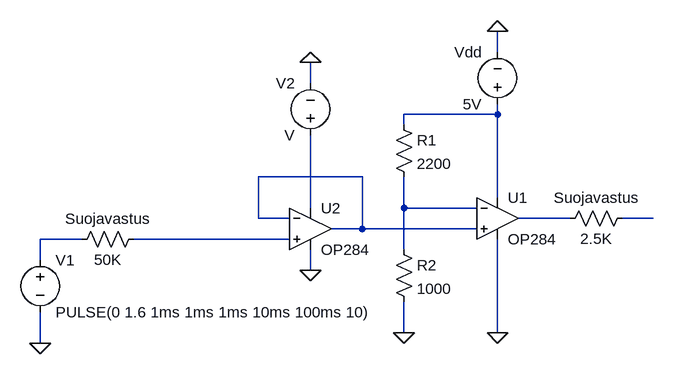
[diagram p0: schematic Ilmankosteus_in.asc]
Ilmankosteus_in.asc, the LTspice schematic file:
Version 4.1
SHEET 1 880 680
WIRE 224 -112 224 -144
WIRE -64 -64 -64 -96
WIRE 224 -16 224 -32
WIRE 224 -16 80 -16
WIRE 80 0 80 -16
WIRE 16 80 -144 80
WIRE 224 112 224 -16
WIRE -64 128 -64 16
WIRE 80 128 80 80
WIRE 192 128 80 128
WIRE -144 144 -144 80
WIRE -96 144 -144 144
WIRE 336 144 256 144
WIRE 464 144 416 144
WIRE 16 160 16 80
WIRE 16 160 -32 160
WIRE 192 160 16 160
WIRE -416 176 -480 176
WIRE -96 176 -336 176
WIRE 80 192 80 128
WIRE -480 208 -480 176
WIRE -64 224 -64 192
WIRE 80 320 80 272
WIRE 224 320 224 176
WIRE -480 336 -480 288
FLAG 80 320 0
FLAG 224 -144 0
FLAG 224 320 0
FLAG -480 336 0
FLAG -64 -96 0
FLAG -64 224 0
SYMBOL OpAmps\\OP284 224 80 R0
SYMATTR InstName U1
SYMBOL res 64 -16 R0
SYMATTR InstName R1
SYMATTR Value 2200
SYMBOL res 64 176 R0
SYMATTR InstName R2
SYMATTR Value 1000
SYMBOL voltage 224 -16 R180
WINDOW 0 24 96 Left 2
WINDOW 3 24 16 Left 2
SYMATTR InstName Vdd
SYMATTR Value 5V
SYMBOL OpAmps\\OP284 -64 96 R0
SYMATTR InstName U2
SYMBOL voltage -480 192 R0
WINDOW 123 0 0 Left 0
WINDOW 39 0 0 Left 0
SYMATTR InstName V1
SYMATTR Value PULSE(0 1.6 1ms 1ms 1ms 10ms 100ms 10)
SYMBOL res -320 160 R90
WINDOW 0 0 56 VBottom 2
WINDOW 3 32 56 VTop 2
SYMATTR InstName Suojavastus
SYMATTR Value 50K
SYMBOL voltage -64 32 R180
WINDOW 0 24 96 Left 2
WINDOW 3 24 16 Left 2
SYMATTR InstName V2
SYMBOL res 432 128 R90
WINDOW 0 0 56 VBottom 2
WINDOW 3 32 56 VTop 2
SYMATTR InstName Suojavastus
SYMATTR Value 2.5K

The netlist it stands for:
* Ilmankosteus_in.asc
X§U1 N002 N004 N001 0 N005 OP284  ; pins In+ In- V+ V- OUT
R1 N001 N004 2200
R2 N004 0 1000
Vdd N001 0 5V
X§U2 N008 N002 N003 0 N002 OP284  ; pins In+ In- V+ V- OUT
V1 N007 0 PULSE(0 1.6 1ms 1ms 1ms 10ms 100ms 10)
R§Suojavastus N008 N007 50K
V2 N003 0 V
R§Suojavastus N006 N005 2.5K
.lib ADI1.lib
.backanno
.end